# Altium schematic sheet BMW E34 Start-Stop Btn.SchDoc
size A4
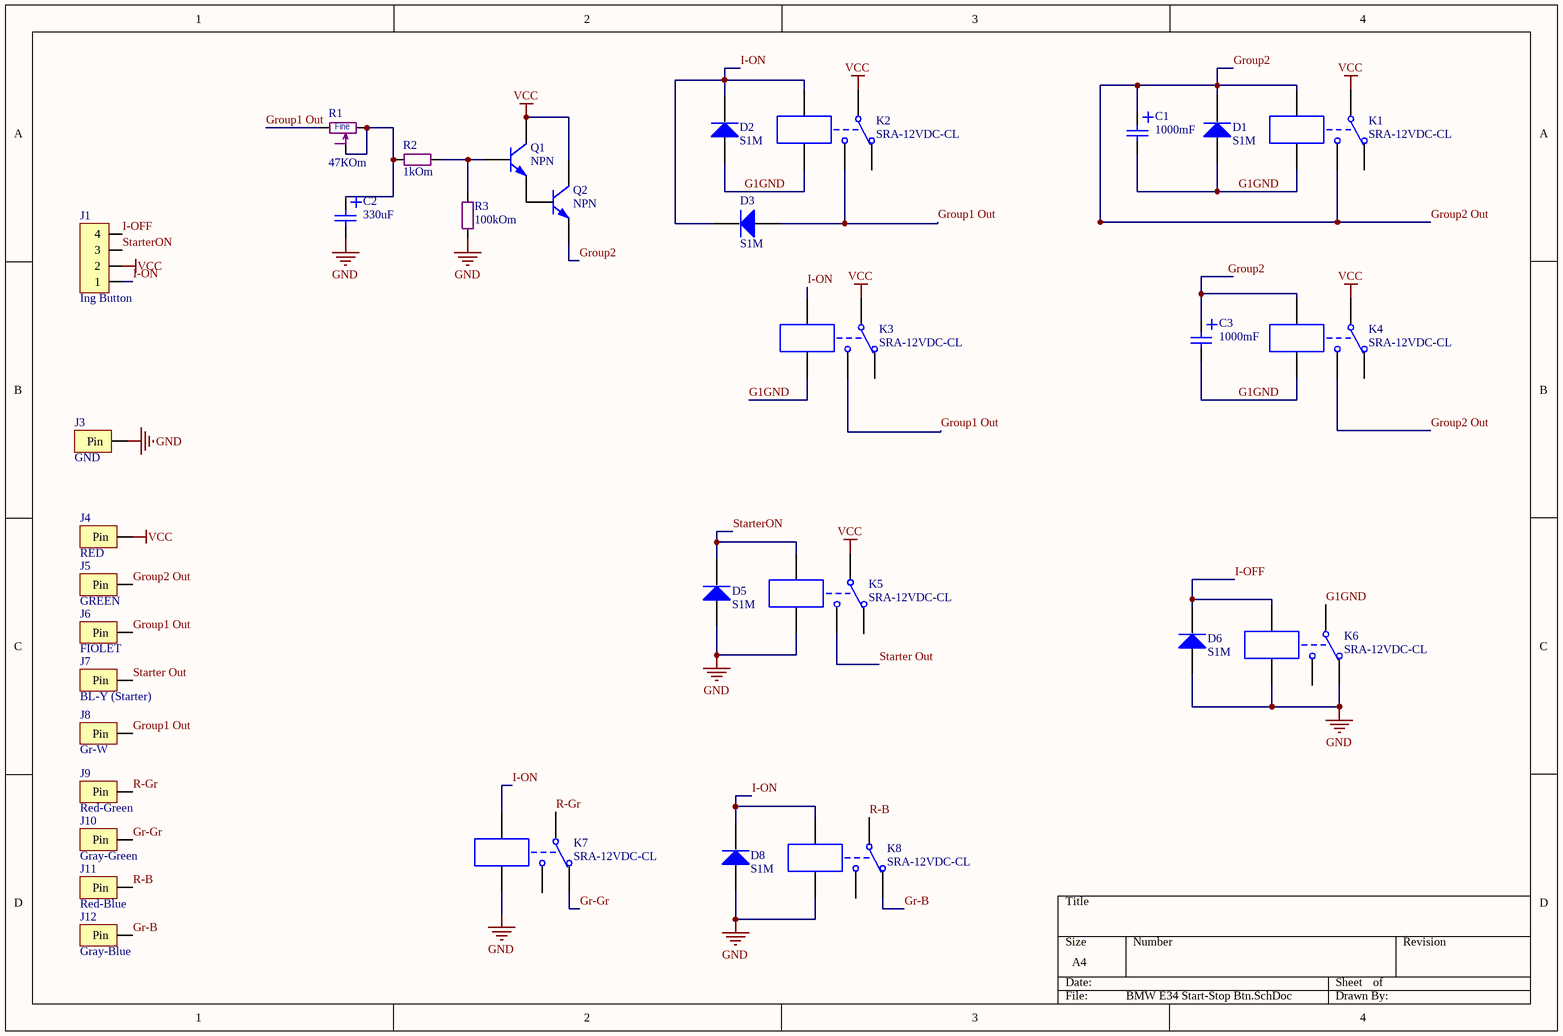
[diagram p0: BMW E34 Start-Stop Btn.SchDoc]

## Parts
C1  1000mF  [Cap E p5.08mm D10.2mm (3p)]
C2  330uF  [Cap E p3.5mm D8xH12]
C3  1000mF  [Cap E p5.08mm D10.2mm (3p)]
D1  S1M  [DO-214AC]
D2  S1M  [DO-214AC]
D3  S1M  [DO-214AC]
D5  S1M  [DO-214AC]
D6  S1M  [DO-214AC]
D8  S1M  [DO-214AC]
J1  Ing Button  [Molex Micro-Fit 3.0 - 4 pin D R]
J3  GND  [OnePin 1.2x3]
J4  RED  [OnePin 1.5x4]
J5  GREEN  [OnePin 1.5x4]
J6  FIOLET  [OnePin 1.5x4]
J7  BL-Y (Starter)  [OnePin 1.5x4]
J8  Gr-W  [OnePin 1x2.5]
J9  Red-Green  [OnePin 1x2.5]
J10  Gray-Green  [OnePin 1x2.5]
J11  Red-Blue  [OnePin 1x2.5]
J12  Gray-Blue  [OnePin 1x2.5]
K1  SRA-12VDC-CL  [SRA-12VDC-CL]
K2  SRA-12VDC-CL  [SRA-12VDC-CL]
K3  SRA-12VDC-CL  [SRA-12VDC-CL]
K4  SRA-12VDC-CL  [SRA-12VDC-CL]
K5  SRA-12VDC-CL  [SRA-12VDC-CL]
K6  SRA-12VDC-CL  [SRA-12VDC-CL]
K7  SRA-12VDC-CL  [SRA-12VDC-CL]
K8  SRA-12VDC-CL  [SRA-12VDC-CL]
Q1  NPN  [TO-92 2.54 (EBC)]
Q2  NPN  [TO-92 2.54 (EBC)]
R1  47КOm  [Res Adj 3296 Univ]
R2  1kOm  [SMD 0805 (2012)]
R3  100kOm  [SMD 0805 (2012)]

## Nets
GND: C2.2 D5.A D6.A D8.A J3.1(Pin) K5.5 K6.1 K6.5 K7.5 K8.5 R3.2
VCC: J1.2 J4.1(Pin) K1.2 K2.2 K3.2 K4.2 K5.2 Q1.C Q2.C
G1GND: C1.2 C3.2 D1.A D2.A K1.5 K2.5 K3.5 K4.5 K6.2
Gr-B: J12.1(Pin) K8.1
Gr-Gr: J10.1(Pin) K7.1
Group1 Out: D3.A J6.1(Pin) J8.1(Pin) K2.3 K3.3 R1.1
Group2: C1.1 C3.1 D1.K J5.1(Pin) K1.3 K1.4 K4.3 K4.4 Q2.E  [also labelled Group2 Out]
I-OFF: D6.K J1.4 K6.4
I-ON: D2.K D3.K D8.K J1.1 K2.4 K3.4 K7.4 K8.4
R-B: J11.1(Pin) K8.2
R-Gr: J9.1(Pin) K7.2
Starter Out: J7.1(Pin) K5.3
StarterON: D5.K J1.3 K5.4
NetC2_1: C2.1 R1.2 R1.3 R2.2
NetQ1_B: Q1.B R2.1 R3.1
NetQ1_E: Q1.E Q2.B

Not connected (* = marked no-connect by the designer): K1 1; K2 1; K3 1; K4 1; K5 1; K6 3; K7 3; K8 3

## Notes on the sheet
- (in symbol Res Adj 3296) Fine

## Library data of the parts
C1 C3 = Cap E 1000mF x 25V: Capacitor
C2 = Cap E 470mF x 25V: Capacitor; Capacity (mF): 470; Voltage (V): 25; Value: 470mF, 25V
D1-D3 D5 D6 D8 = Diode S1M: 1 Amp General Purpose Rectifier; Maximum Repetitive Reverse Voltage: 1000V; IF(AV) Average Rectified Forward Current: 1A; PackageReference: DO-214AC; VALUE: S1M
J1 = Micro-Fit 4R (2x2): Horisontal, Dbl line, Male - 3mm; Part Number: 0430450402; Name: Micro-Fit 3.0; URL: http://www.molex.com/molex/products/datasheet.jsp?part=active/0430450402_PCB_HEADERS.xml
J3-J12 = OnePin Connector: Only pad
K1-K8 = SRA-12VDC-CL: Single-Pole Dual-Throw Relay; R обм: 240 Om; I (DC = 30 V): 10A; I (AC = 240 V): 15-20A; U: 12 V; Name: SRA-12VDC-CL; DataSheet: http://tec.org.ru/_bd/12/1208_SRA.pdf
Q1 Q2 = NPN: NPN Bipolar Transistor; Published: 8-Jun-2000; LatestRevisionDate: 17-Jul-2002; LatestRevisionNote: Re-released for DXP Platform.; PackageReference: TO-226-AA; Publisher: Altium Limited; PackageDescription: TO, Flat Index; 3 In-Line, Axial Leads; Body Dia. 4.8mm; Leads 0.55 x 0.51 mm (max); Code_JEDEC: TO-226-AA
R1 = Res Adj 3296
R2 R3 = Res SMD 0805